# EAGLE design SympleEncoderBoard (EAGLE 9.6.2)
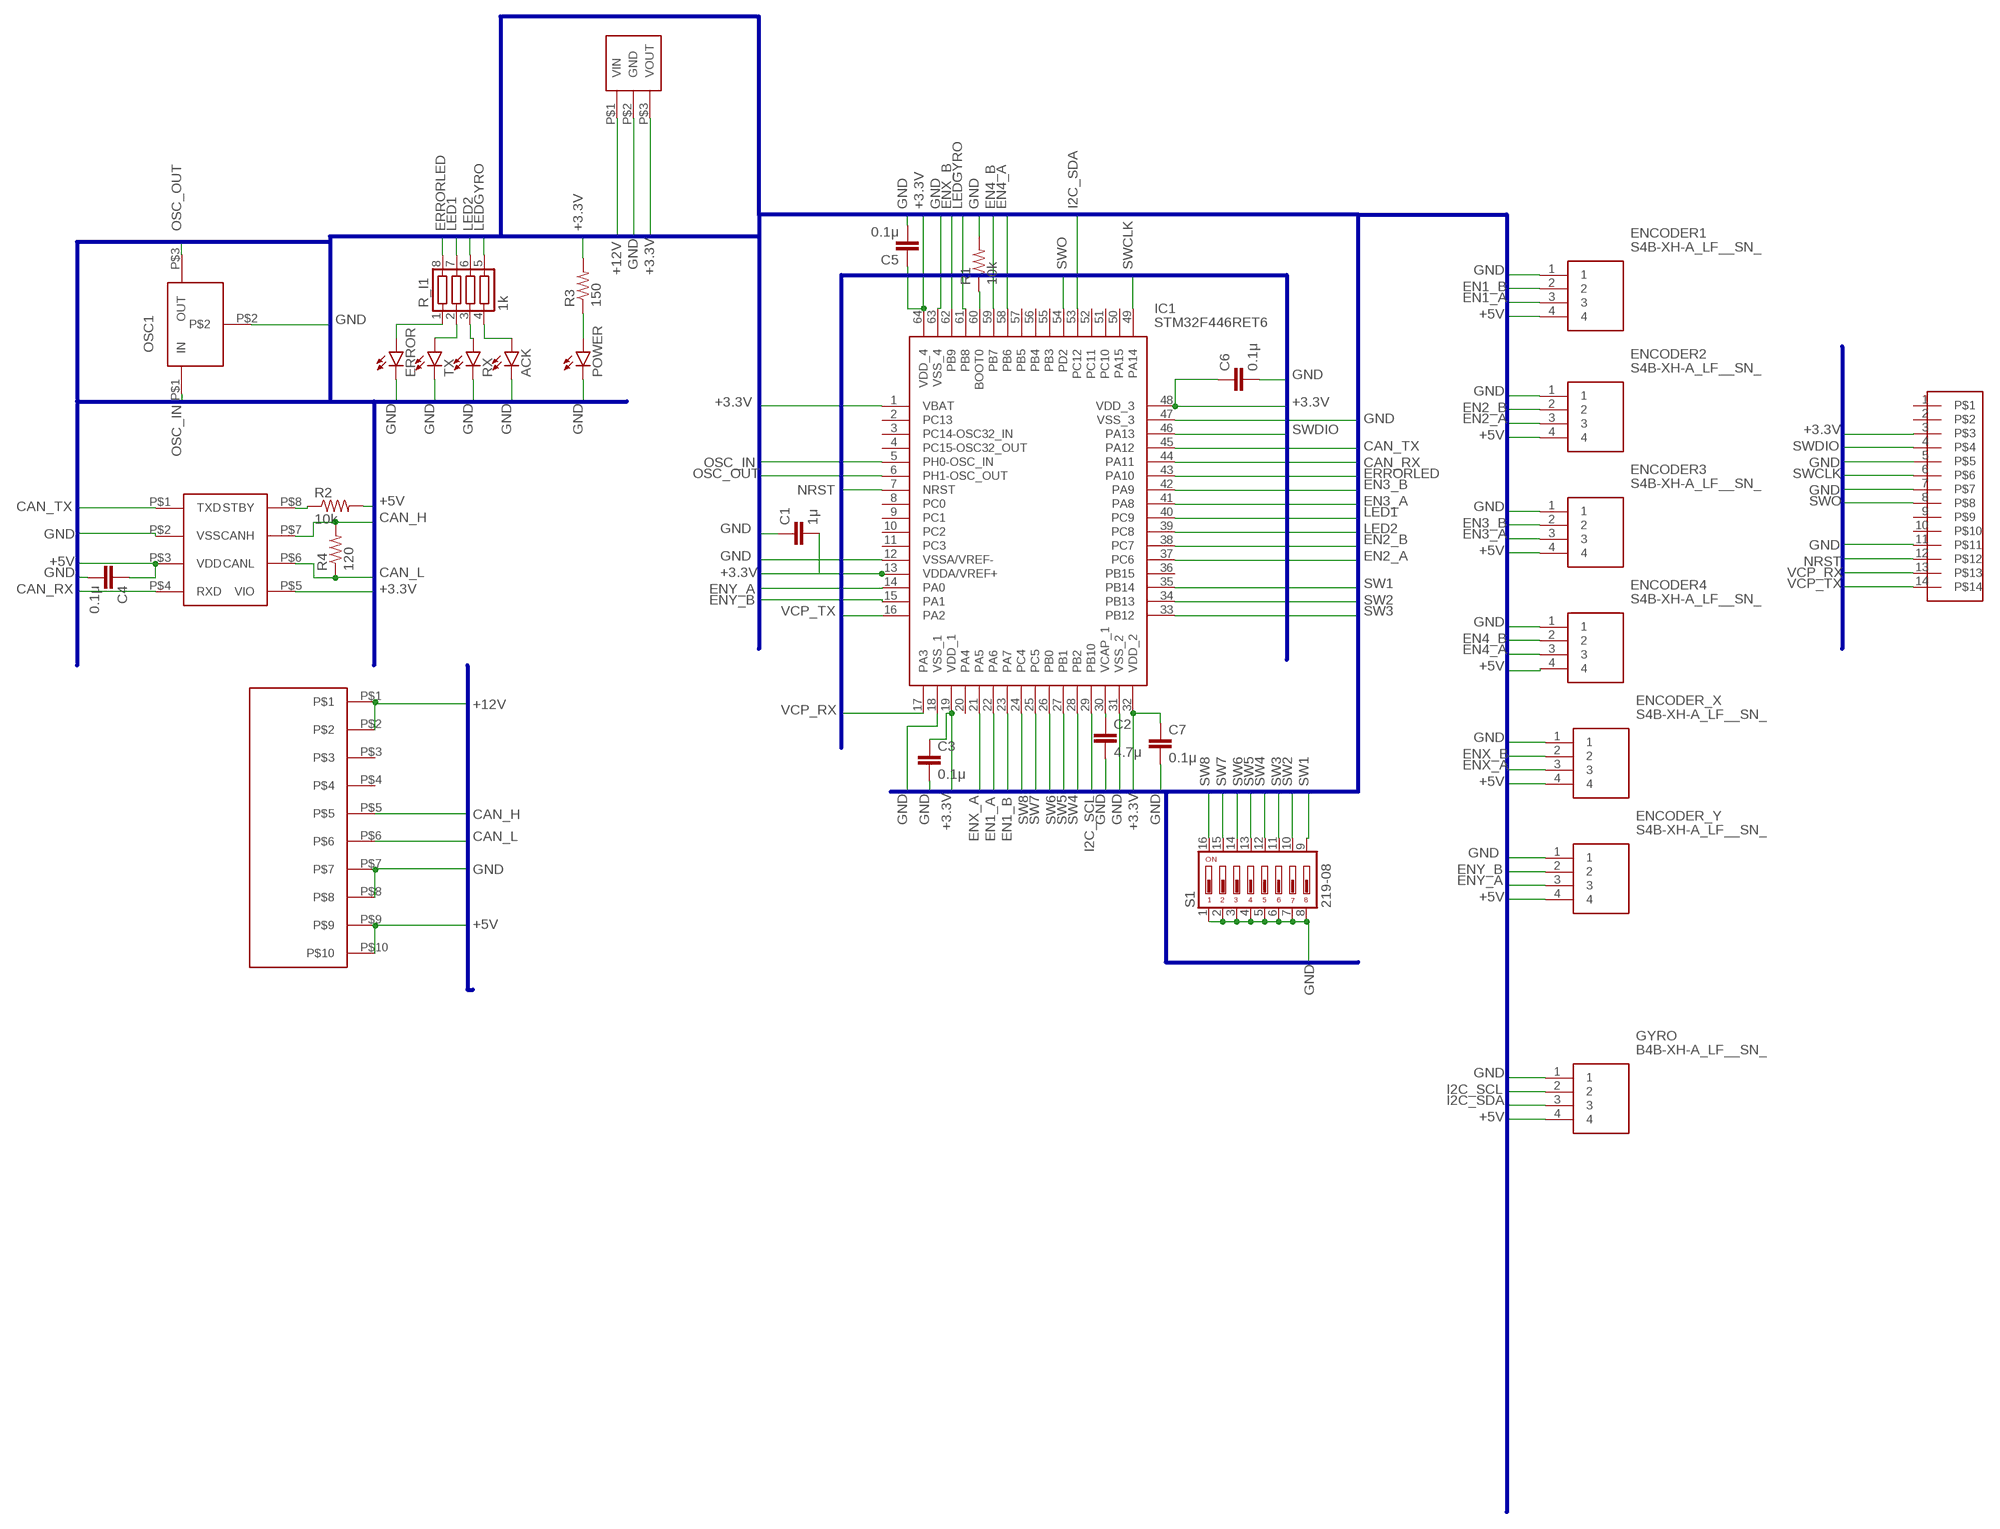
[diagram p0: schematic, sheet 1]

## Parts
ACK  LEDCHIPLED_0603  [CHIPLED_0603]
C1  1μ  C-EUC1608  [C1608]
C2  4.7μ  C-EUC0603  [C0603]
C3  0.1μ  C-EUC0603  [C0603]
C4  0.1μ  C-EUC1608  [C1608]
C5  0.1μ  C-EUC0603  [C0603]
C6  0.1μ  C-EUC0603  [C0603]
C7  0.1μ  C-EUC0603  [C0603]
ENCODER1  S4B-XH-A_LF__SN_  [SHDRRA4W64P0X250_1X4_1240X1150]
ENCODER2  S4B-XH-A_LF__SN_  [SHDRRA4W64P0X250_1X4_1240X1150]
ENCODER3  S4B-XH-A_LF__SN_  [SHDRRA4W64P0X250_1X4_1240X1150]
ENCODER4  S4B-XH-A_LF__SN_  [SHDRRA4W64P0X250_1X4_1240X1150]
ENCODER_X  S4B-XH-A_LF__SN_  [SHDRRA4W64P0X250_1X4_1240X1150]
ENCODER_Y  S4B-XH-A_LF__SN_  [SHDRRA4W64P0X250_1X4_1240X1150]
ERROR  LEDCHIPLED_0603  [CHIPLED_0603]
GYRO  B4B-XH-A_LF__SN_  [SHDR4W64P0X250_1X4_1240X575X70]
IC1  STM32F446RET6  [QFP50P1200X1200X160-64N]
OSC1  CSTN#  [CSTNE#]
POWER  LEDCHIPLED_0603  [CHIPLED_0603]
R1  10k  R-US_R0603  [R0603]
R2  10k  R-US_R0603  [R0603]
R3  150  R-US_R0603  [R0603]
R4  120  R-US_R0603  [R0603]
R_I1  1k  R_SHUGOU  [0603X4RESISTOR]
RX  LEDCHIPLED_0603  [CHIPLED_0603]
S1  219-08  [CTS-219-08]
TX  LEDCHIPLED_0603  [CHIPLED_0603]
U$1  BOX14P  [CON_HEDA14P_1.27]
U$2  BP5293-33  [DC/DC_REGULATOR_3P]
U$3  MCP2562MCP2561-SN  [SOIC8]
U$4  BOX10PBOX10P-L  [BOX10P-L]

## Nets
+3.3V: C1.2 C3.1 C5.1 C6.1 C7.1 IC1.1(VBAT) IC1.13(VDDA/VREF+) IC1.19(VDD_1) IC1.32(VDD_2) IC1.48(VDD_3) IC1.64(VDD_4) R3.2 U$1.3 U$2.P$3(VOUT) U$3.P$5(VIO)
+5V: C4.1 ENCODER1.4 ENCODER2.4 ENCODER3.4 ENCODER4.4 ENCODER_X.4 ENCODER_Y.4 GYRO.4 R2.2 U$3.P$3(VDD) U$4.P$9 U$4.P$10
+12V: U$2.P$1(VIN) U$4.P$1 U$4.P$2
CAN_H: R4.2 U$3.P$7(CANH) U$4.P$5
CAN_L: R4.1 U$3.P$6(CANL) U$4.P$6
CAN_RX: IC1.44(PA11) U$3.P$4(RXD)
CAN_TX: IC1.45(PA12) U$3.P$1(TXD)
EN1_A: ENCODER1.3 IC1.22(PA6)
EN1_B: ENCODER1.2 IC1.23(PA7)
EN2_A: ENCODER2.3 IC1.37(PC6)
EN2_B: ENCODER2.2 IC1.38(PC7)
EN3_A: ENCODER3.3 IC1.41(PA8)
EN3_B: ENCODER3.2 IC1.42(PA9)
EN4_A: ENCODER4.3 IC1.58(PB6)
EN4_B: ENCODER4.2 IC1.59(PB7)
ENX_A: ENCODER_X.3 IC1.21(PA5)
ENX_B: ENCODER_X.2 IC1.62(PB9)
ENY_A: ENCODER_Y.3 IC1.14(PA0)
ENY_B: ENCODER_Y.2 IC1.15(PA1)
ERRORLED: IC1.43(PA10) R_I1.8
GND: ACK.C C1.1 C2.2 C3.2 C4.2 C5.2 C6.2 C7.2 ENCODER1.1 ENCODER2.1 ENCODER3.1 ENCODER4.1 ENCODER_X.1 ENCODER_Y.1 ERROR.C GYRO.1 IC1.12(VSSA/VREF-) IC1.18(VSS_1) IC1.31(VSS_2) IC1.47(VSS_3) IC1.63(VSS_4) OSC1.P$2 POWER.C R1.2 RX.C S1.1 S1.2 S1.3 S1.4 S1.5 S1.6 S1.7 S1.8 TX.C U$1.5 U$1.7 U$1.11 U$2.P$2(GND) U$3.P$2(VSS) U$4.P$7 U$4.P$8
I2C_SCL: GYRO.2 IC1.29(PB10)
I2C_SDA: GYRO.3 IC1.53(PC12)
LED1: IC1.40(PC9) R_I1.7
LED2: IC1.39(PC8) R_I1.6
LEDGYRO: IC1.61(PB8) R_I1.5
N$1: IC1.60(BOOT0) R1.1
N$2: C2.1 IC1.30(VCAP_1)
N$3: ERROR.A R_I1.1
N$4: R_I1.2 TX.A
N$5: R_I1.3 RX.A
N$6: ACK.A R_I1.4
N$7: R2.1 U$3.P$8(STBY)
N$8: POWER.A R3.1
NRST: IC1.7(NRST) U$1.12
OSC_IN: IC1.5(PH0-OSC_IN) OSC1.P$1(IN)
OSC_OUT: IC1.6(PH1-OSC_OUT) OSC1.P$3(OUT)
SW1: IC1.35(PB14) S1.9
SW2: IC1.34(PB13) S1.10
SW3: IC1.33(PB12) S1.11
SW4: IC1.28(PB2) S1.12
SW5: IC1.27(PB1) S1.13
SW6: IC1.26(PB0) S1.14
SW7: IC1.25(PC5) S1.15
SW8: IC1.24(PC4) S1.16
SWCLK: IC1.49(PA14) U$1.6
SWDIO: IC1.46(PA13) U$1.4
SWO: IC1.54(PD2) U$1.8
VCP_RX: IC1.17(PA3) U$1.13
VCP_TX: IC1.16(PA2) U$1.14
Unconnected: IC1.2(PC13) IC1.3(PC14-OSC32_IN) IC1.4(PC15-OSC32_OUT) IC1.8(PC0) IC1.9(PC1) IC1.10(PC2) IC1.11(PC3) IC1.20(PA4) IC1.36(PB15) IC1.50(PA15) IC1.51(PC10) IC1.52(PC11) IC1.55(PB3) IC1.56(PB4) IC1.57(PB5) U$1.1 U$1.2 U$1.9 U$1.10 U$4.P$3 U$4.P$4

## Buses
+3.3V,GND,NRST,SWCLK,SWDIO,SWO,VCP_RX,VCP_TX
+3.3V,+5V,+12V,CAN_H,CAN_L,CAN_RX,CAN_TX,EN1_A,EN1_B,EN2_A,EN2_B,EN3_A,EN3_B,EN4_A,EN4_B,ENX_A,ENX_B,ENY_A,ENY_B,ERRORLED,GND,I2C_SCL,I2C_SDA,LED1,LED2,LEDGYRO,OSC_IN,OSC_OUT,SW1,SW2,SW3,SW4,SW5,SW6,SW7,SW8,SW9
+5V,+12V,CAN_H,CAN_L,GND

## Library data of the parts
ACK ERROR POWER RX TX = led:LED: LED OSRAM: - CHIPLED LG R971, LG N971, LY N971, LG Q971, LY Q971, LO R971, LY R971 LH N974, LH R974 LS Q976, LO Q976, LY Q976 LO Q996 - Hyper CHIPLED LW Q18S LB Q993, LB Q99A, LB R99A - SideLED LS A670, LO A670, LY A670, LG A670, LP A670 LB A673, LV A673, LT A673, LW A673 LH A674 LY A675 LS A676, LA A676, LO A676, LY A676, LW A676 LS A679, LY A679, LG A679 - Hyper Micro SIDELED® LS Y876, LA Y876, LO Y876, LY Y876 LT Y87S - SmartLED LW L88C, LW L88S LB L89C, LB L89S, LG L890 LS L89K, LO L89K, LY L89K LS L896, LA L896, LO L896, LY L896 - TOPLED LS T670, LO T670, LY T670, LG T670, LP T670 LSG T670, LSP T670, LSY T670, LOP T670, LYG T670 LG T671, LOG T671, LSG T671 LB T673, LV T673, LT T673, LW T673 LH T674 LS T676, LA T676, LO T676, LY T676, LB T676, LH T676, LSB T676, LW T676 LB T67C, LV T67C, LT T67C, LS T67K, LO T67K, LY T67K, LW E67C LS E67B, LA E67B, LO E67B, LY E67B, LB E67C, LV E67C, LT E67C LW T67C LS T679, LY T679, LG T679 LS T770, LO T770, LY T770, LG T770, LP T770 LB T773, LV T773, LT T773, LW T773 LH T774 LS E675, LA E675, LY E675, LS T675 LS T776, LA T776, LO T776, LY T776, LB T776 LHGB T686 LT T68C, LB T68C - Hyper Mini TOPLED® LB M676 - Mini TOPLED Santana® LG M470 LS M47K, LO M47K, LY M47K Source: http://www.osram.convergy.de LUXEON: - LUMILED® LXK2-PW12-R00, LXK2-PW12-S00, LXK2-PW14-U00, LXK2-PW14-V00 LXK2-PM12-R00, LXK2-PM12-S00, LXK2-PM14-U00 LXK2-PE12-Q00, LXK2-PE12-R00, LXK2-PE12-S00, LXK2-PE14-T00, LXK2-PE14-U00 LXK2-PB12-K00, LXK2-PB12-L00, LXK2-PB12-M00, LXK2-PB14-N00, LXK2-PB14-P00, LXK2-PB14-Q00 LXK2-PR12-L00, LXK2-PR12-M00, LXK2-PR14-Q00, LXK2-PR14-R00 LXK2-PD12-Q00, LXK2-PD12-R00, LXK2-PD12-S00 LXK2-PH12-R00, LXK2-PH12-S00 LXK2-PL12-P00, LXK2-PL12-Q00, LXK2-PL12-R00 Source: www.luxeon.com KINGBRIGHT: KA-3528ASYC Source: www.kingbright.com
C1-C7 = rcl:C-EU: CAPACITOR, European symbol; SPICEPREFIX: C
ENCODER1-ENCODER4 ENCODER_X ENCODER_Y = S4B-XH-A_LF__SN_:S4B-XH-A_LF__SN_: XH-2.5mm Header side entry 4 way JST XH Series, Series Number S4B, 2.5mm Pitch 4 Way 1 Row Right Angle PCB Header, Solder Termination, 3A Source: Datasheet <http://uk.rs-online.com/web/p/products/8201589P>; DESCRIPTION: XH-2.5mm Header side entry 4 way JST XH Series, Series Number S4B, 2.5mm Pitch 4 Way 1 Row Right Angle PCB Header, Solder Termination, 3A; HEIGHT: 7mm; MANUFACTURER_NAME: JST (JAPAN SOLDERLESS TERMINALS); MANUFACTURER_PART_NUMBER: S4B-XH-A(LF)(SN); RS_PART_NUMBER: 8201589P; RS_PRICE-STOCK: http://uk.rs-online.com/web/p/products/8201589P
GYRO = B4B-XH-A_LF__SN_:B4B-XH-A_LF__SN_: XH-2.5mm Header top entry 4 way JST XH Series, Series Number B4B, 2.5mm Pitch 4 Way 1 Row Straight PCB Header, Solder Termination, 3A Source: Datasheet <http://uk.rs-online.com/web/p/products/8201551P>; DESCRIPTION: XH-2.5mm Header top entry 4 way JST XH Series, Series Number B4B, 2.5mm Pitch 4 Way 1 Row Straight PCB Header, Solder Termination, 3A; HEIGHT: 7mm; MANUFACTURER_NAME: JST (JAPAN SOLDERLESS TERMINALS); MANUFACTURER_PART_NUMBER: B4B-XH-A(LF)(SN); RS_PART_NUMBER: 8201551P; RS_PRICE-STOCK: http://uk.rs-online.com/web/p/products/8201551P
IC1 = STM32F446RET6:STM32F446RET6: 32-Bit MCU+DSP 512K Flash 180MHz LQFP64 STMicroelectronics STM32F446RET6, 32bit ARM Cortex M4 MCU, 180MHz, 512 kB Flash, 64-Pin LQFP Source: Datasheet <http://uk.rs-online.com/web/p/products/1106621P>; DESCRIPTION: 32-Bit MCU+DSP 512K Flash 180MHz LQFP64 STMicroelectronics STM32F446RET6, 32bit ARM Cortex M4 MCU, 180MHz, 512 kB Flash, 64-Pin LQFP; HEIGHT: 1.6mm; MANUFACTURER_NAME: STMicroelectronics; MANUFACTURER_PART_NUMBER: STM32F446RET6; RS_PART_NUMBER: 1106621P; RS_PRICE-STOCK: http://uk.rs-online.com/web/p/products/1106621P
OSC1 = user_osc:CSTN#: ムラタのセラロック （セラミック振動子） 周波数はいくつか種類あり(valueで設定して) 秋月電子通商のトップ/パーツ一般/発振子/セラミック発振子 uCからのoutが入るのがinであることに注意 https://akizukidenshi.com/catalog/c/cceralock/
R1-R4 = rcl:R-US_: RESISTOR, American symbol; SPICEPREFIX: R
R_I1 = user_rcl:R_SHUGOU
S1 = switch-dil:219-08*: Surface Mount DIP Switch Series 219 SMT CTS Electronic Components Sourc: www.ctscorp.com; OC_FARNELL: unknown; OC_NEWARK: unknown
U$1 = user_conector:BOX14P
U$2 = SympleEncoderBoard:BP5293-33
U$3 = user_ic:MCP2562
U$4 = user_conector:BOX10P

## Board
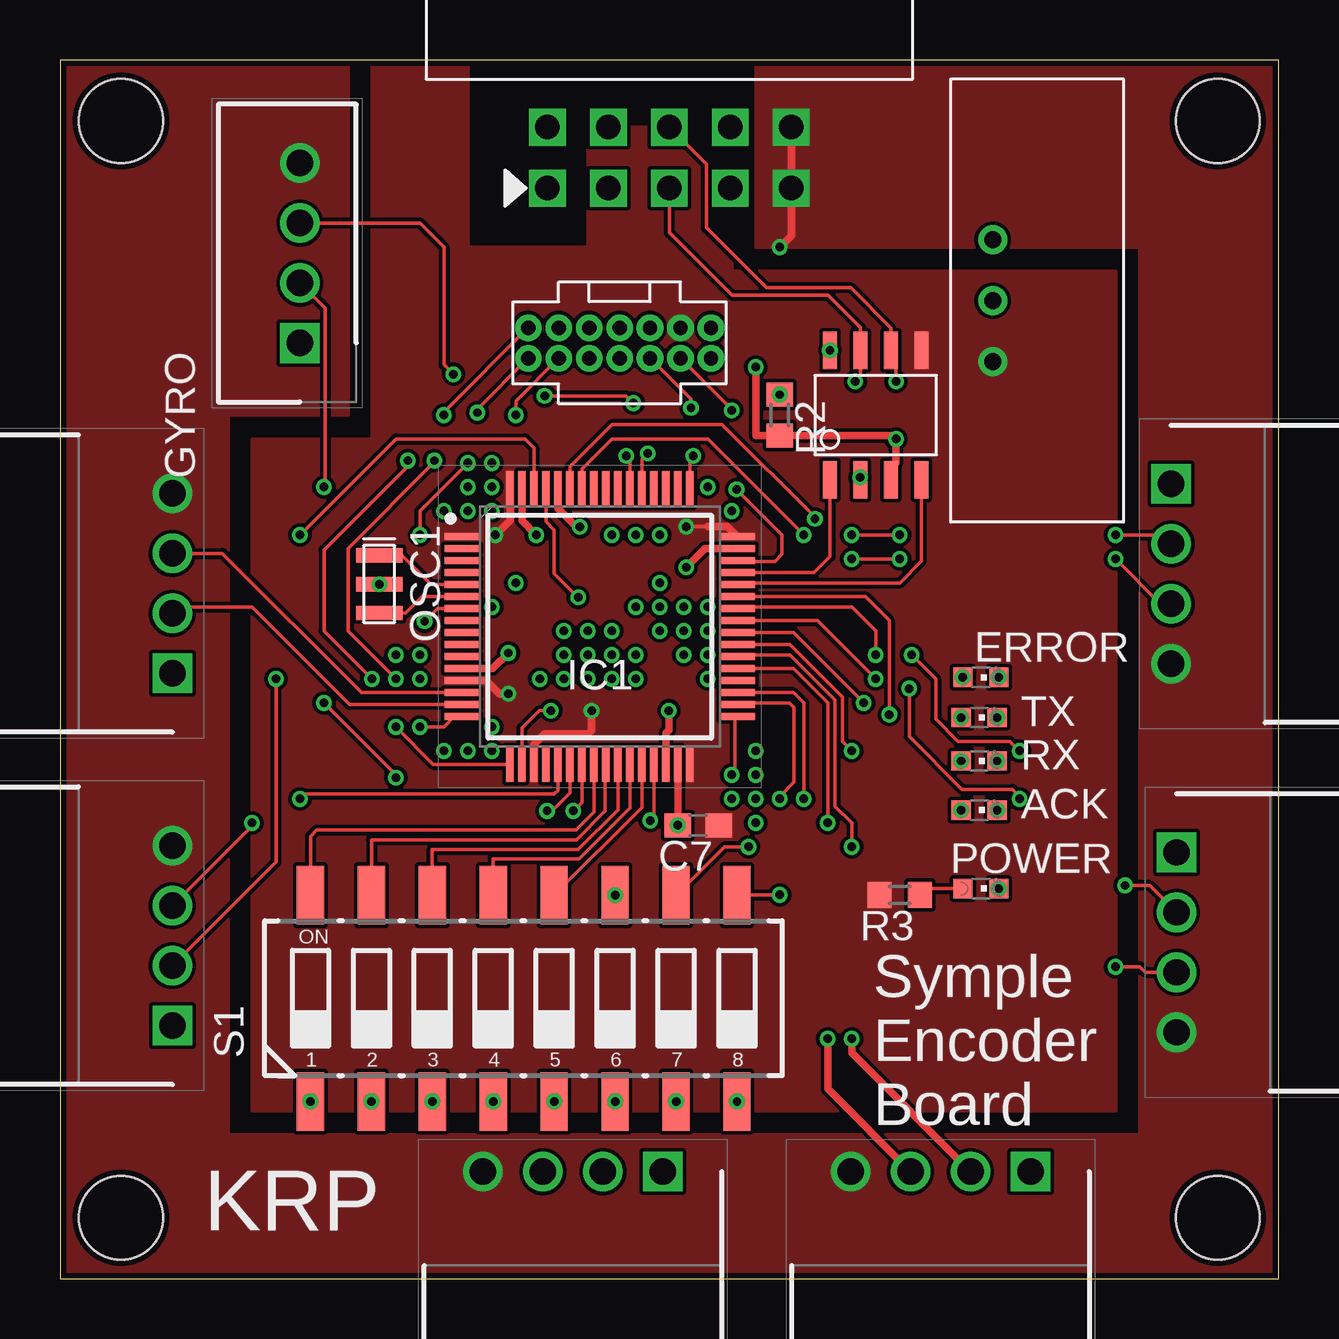
[diagram p1: board, top side]
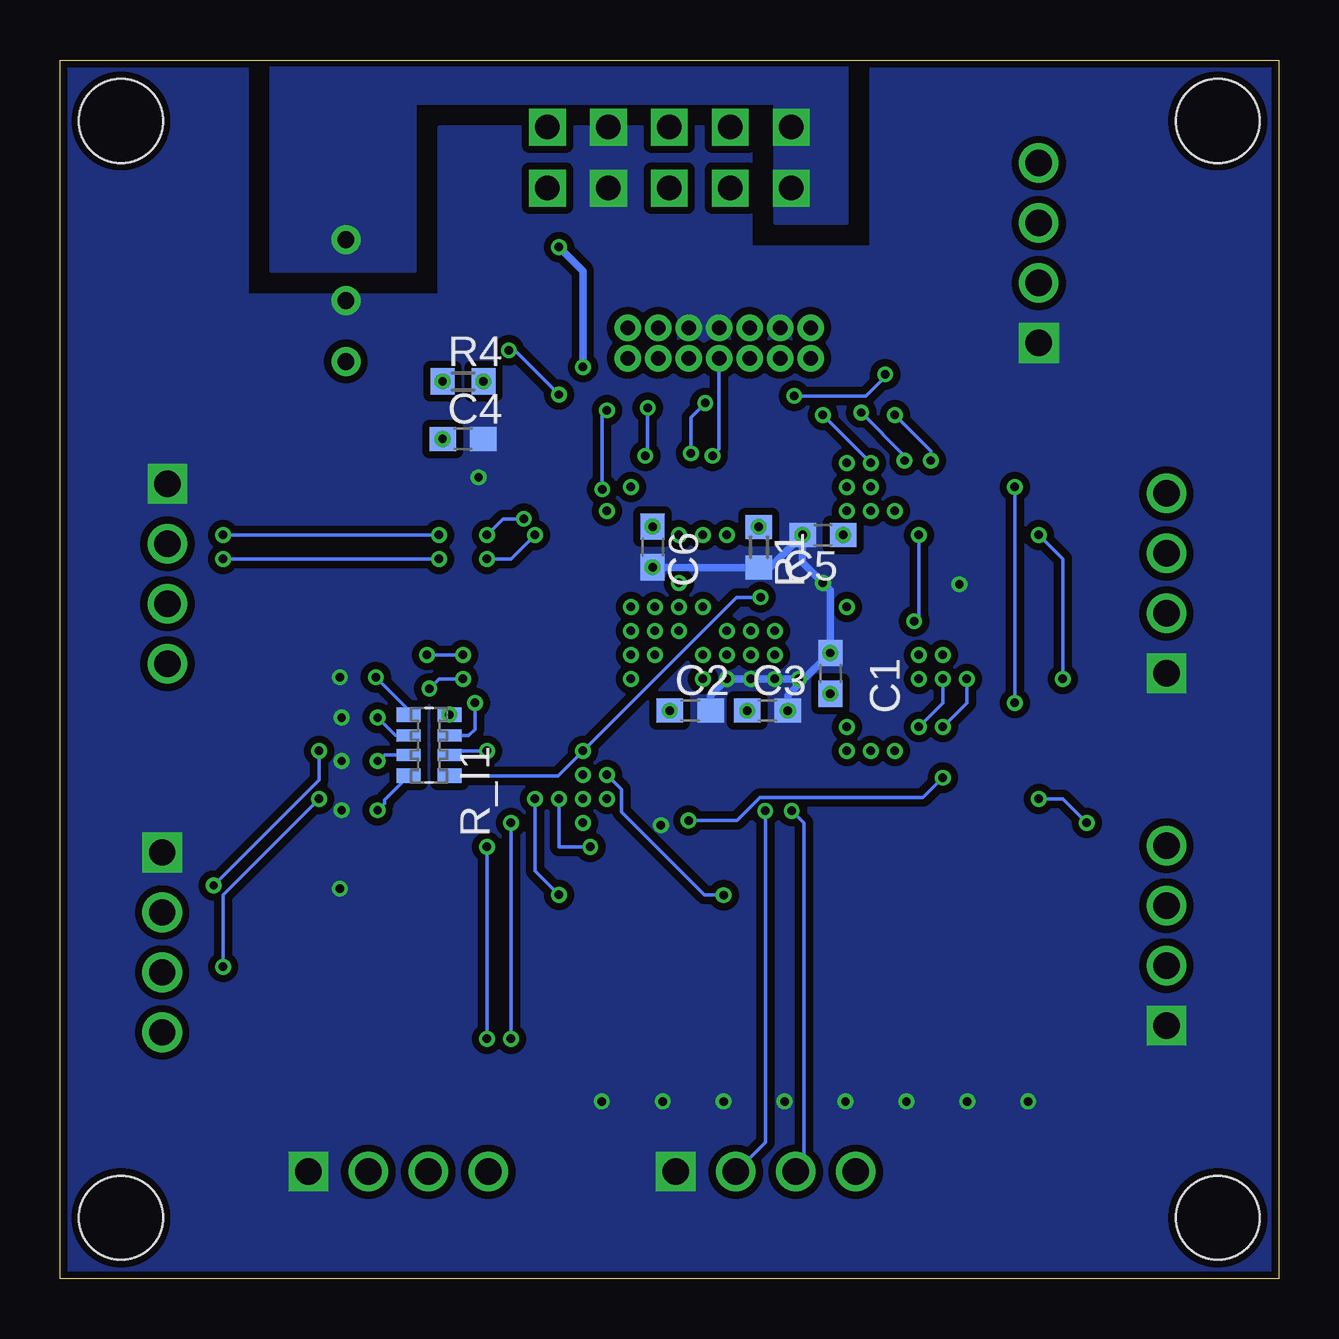
[diagram p2: board, bottom side, seen from below]

Size 50.8 x 50.8 mm. Coordinates in mm from the lower left corner, seen from the top.
Outline: 0,0 50.8,0 50.8,50.8 0,50.8 0,0
Copper layers (1*16): Top 0.035mm / dielectric 1.5mm / Bottom 0.035mm
Design rules "SeeedStudio_2layer_DRU_no_angle_20140221": minimum track width 6mil, minimum drill 12mil, track to track 6mil, track to pad 6mil, pad to pad 6mil, via to via 6mil, smd to smd 0mil, copper to edge 10mil, drill to drill 10mil, minimum pad ring 10mil, minimum via ring 6mil, stop-mask expansion 2mil, vias tented up to drill 100mil, thermal gap 10mil
Holes 3.5 mm at 2.54,2.54 48.26,2.54 48.26,48.26 2.54,48.26

### Footprints (pad centres in the part's own frame; a part is rotated, then mirrored left to right if it is on the bottom)
CHIPLED_0603 = smd 0.8 x 0.8: A 0,-0.75; C 0,0.75
C1608 = smd 1.1 x 1: 1 -0.85,0; 2 0.85,0
C0603 = smd 1.1 x 1: 1 -0.85,0; 2 0.85,0
SHDRRA4W64P0X250_1X4_1240X1150 = drill 1.1 pad 1.65 square: 1 0,0 | drill 1.1 pad 1.65: 2 2.5,0; 3 5,0; 4 7.5,0
SHDR4W64P0X250_1X4_1240X575X70 = drill 1.1 pad 1.65 square: 1 0,0 | drill 1.1 pad 1.65: 2 2.5,0; 3 5,0; 4 7.5,0
QFP50P1200X1200X160-64N = smd 1.475 x 0.3: 1 -5.738,3.75; 2 -5.738,3.25; 3 -5.738,2.75; 4 -5.738,2.25; 5 -5.738,1.75; 6 -5.738,1.25; 7 -5.738,0.75; 8 -5.738,0.25; 9 -5.738,-0.25; 10 -5.738,-0.75; 11 -5.738,-1.25; 12 -5.738,-1.75; 13 -5.738,-2.25; 14 -5.738,-2.75; 15 -5.738,-3.25; 16 -5.738,-3.75; 33 5.738,-3.75; 34 5.738,-3.25; 35 5.738,-2.75; 36 5.738,-2.25; 37 5.738,-1.75; 38 5.738,-1.25; 39 5.738,-0.75; 40 5.738,-0.25; 41 5.738,0.25; 42 5.738,0.75; 43 5.738,1.25; 44 5.738,1.75; 45 5.738,2.25; 46 5.738,2.75; 47 5.738,3.25; 48 5.738,3.75 | smd 0.3 x 1.475: 17 -3.75,-5.738; 18 -3.25,-5.738; 19 -2.75,-5.738; 20 -2.25,-5.738; 21 -1.75,-5.738; 22 -1.25,-5.738; 23 -0.75,-5.738; 24 -0.25,-5.738; 25 0.25,-5.738; 26 0.75,-5.738; 27 1.25,-5.738; 28 1.75,-5.738; 29 2.25,-5.738; 30 2.75,-5.738; 31 3.25,-5.738; 32 3.75,-5.738; 49 3.75,5.738; 50 3.25,5.738; 51 2.75,5.738; 52 2.25,5.738; 53 1.75,5.738; 54 1.25,5.738; 55 0.75,5.738; 56 0.25,5.738; 57 -0.25,5.738; 58 -0.75,5.738; 59 -1.25,5.738; 60 -1.75,5.738; 61 -2.25,5.738; 62 -2.75,5.738; 63 -3.25,5.738; 64 -3.75,5.738
CSTNE# = smd 0.6 x 1.95: P$1 0,0; P$2 1.2,0; P$3 2.4,0
R0603 = smd 1 x 1.1: 1 -0.85,0; 2 0.85,0
0603X4RESISTOR = smd 0.6 x 1: 1 -1.275,-0.85; 4 1.275,-0.85; 5 1.275,0.85; 8 -1.275,0.85 | smd 0.5 x 1: 2 -0.4,-0.85; 3 0.4,-0.85; 6 0.4,0.85; 7 -0.4,0.85
CTS-219-08 = smd 1.13 x 2.44: 1 -8.89,-4.3; 2 -6.35,-4.3; 3 -3.81,-4.3; 4 -1.27,-4.3; 5 1.27,-4.3; 6 3.81,-4.3; 7 6.35,-4.3; 8 8.89,-4.3; 9 8.89,4.3; 10 6.35,4.3; 11 3.81,4.3; 12 1.27,4.3; 13 -1.27,4.3; 14 -3.81,4.3; 15 -6.35,4.3; 16 -8.89,4.3
CON_HEDA14P_1.27 = drill 0.6: 1 1.08,8.255; 2 2.35,8.255; 3 1.08,6.985; 4 2.35,6.985; 5 1.08,5.715; 6 2.35,5.715; 7 1.08,4.445; 8 2.35,4.445; 9 1.08,3.175; 10 2.35,3.175; 11 1.08,1.905; 12 2.35,1.905; 13 1.08,0.635; 14 2.35,0.635
DC/DC_REGULATOR_3P = drill 0.7: P$1 -2.54,0; P$2 0,0; P$3 2.54,0
SOIC8 = smd 1.55 x 0.6: P$1 -2.7,1.905; P$2 -2.7,0.635; P$3 -2.7,-0.635; P$4 -2.7,-1.905; P$5 2.7,-1.905; P$6 2.7,-0.635; P$7 2.7,0.635; P$8 2.7,1.905
BOX10P-L = drill 1.02 square: P$1 5.08,2.54; P$2 5.08,0; P$3 2.54,2.54; P$4 2.54,0; P$5 0,2.54; P$6 0,0; P$7 -2.54,2.54; P$8 -2.54,0; P$9 -5.08,2.54; P$10 -5.08,0

### Placement (x,y rotation side)
ACK  38.31,19.53 270 top
C1  18.69,25.23 270 bottom
C2  24.53,23.68 0 bottom
C3  21.31,23.68 0 bottom
C4  34,35 0 bottom
C5  19,31 180 bottom
C6  26.1,30.5 270 bottom
C7  26.6,18.9 180 top
ENCODER1  25.13,4.46 180 top
ENCODER2  40.45,4.46 180 top
ENCODER3  46.54,17.77 270 top
ENCODER4  46.32,33.13 270 top
ENCODER_X  4.68,10.55 90 top
ENCODER_Y  4.68,25.23 90 top
ERROR  38.38,25.07 270 top
GYRO  10,39 90 top
IC1  22.5,27.18 0 top
OSC1  13.31,30.15 270 top
POWER  38.38,16.26 270 top
R1  21.67,30.49 270 bottom
R2  30,36 270 top
R3  35,16 180 top
R4  34,37.4 0 bottom
R_I1  35.42,22.24 270 bottom
RX  38.31,21.58 270 top
S1  19.33,11.69 0 top
TX  38.31,23.39 270 top
U$1  18.88,40.72 270 top
U$2  38.88,40.77 270 top
U$3  34,36 90 top
U$4  25.4,48 180 top

### Tracks (layer width: path | path; a pad name or v marks a point on that pad's centre or on a via)
+3.3V  (via drill 0.35)
  Top 0.152: C6.1 27,31.35
  Top 0.305: IC1.64 18.75,31.6 C5.1 | C1.2 18.32,24.38 17.77,24.93 IC1.13 | 27,31.35 27.82,31.35 IC1.48 | C3.1 22.16,22.86 22,22.7 20.19,22.7 19.75,22.26 IC1.19
  other vias: 18.15,31 18.69,24.38 26.1,31.35 22.16,23.68
  pour Top (rank 3, no thermals): 8,7 44,7 44,42 28,42 28,48 22,48 22,43 17,43 17,51 13,51 13,35 8,35
+5V  (via drill 0.35)
  Top 0.305: U$3.P$3 34.63,33.78 34.85,34 C4.1 34.7,35.15 R2.2 29,35.15 v29,38 | U$4.P$10 U$4.P$9 30.48,43.48 v30,43
  Bottom 0.305: v30,43 29,42 v29,38
  other vias: 34.85,35
  pour Top (no thermals): 29,51 29,43 45,43 45,6 7,6 7,36 12,36 12,51 0,51 0,0 51,0 51,51
+12V
  pour Bottom (no thermals): 21,44 21,49 36,49 36,42 42,42 42,51 18,51 18,44
CAN_H  (via drill 0.35)
  Top 0.152: R4.2 33.37,37.62 U$3.P$7 33.37,39.63 32,41 28,41 25.4,43.6 U$4.P$5
  other vias: 33.15,37.4
CAN_L  (via drill 0.35)
  Top 0.152: R4.1 34.85,38.48 U$3.P$6 34.63,39.63 32.96,41.3 29.44,41.3 26.95,43.8 26.95,46.45 U$4.P$6
  other vias: 34.85,37.4
CAN_RX
  Top 0.152: IC1.44 28.31,29 35,29 35.91,29.91 U$3.P$4
CAN_TX
  Top 0.152: IC1.45 31.43,29.43 32.09,30.09 U$3.P$1
EN1_A  (via drill 0.35)
  Top 0.152: IC1.22 21.25,20.25 20.5,19.5 v20.3,19.5
  Bottom 0.152: v20.3,19.5 19.8,19 19.8,4.79 ENCODER1.3
EN1_B  (via drill 0.35)
  Top 0.152: IC1.23 21.75,19.85 v21.4,19.5
  Bottom 0.152: v21.4,19.5 21.4,5.69 ENCODER1.2
EN2_A  (via drill 0.35)
  Top 0.152: v32,19 32,24 30.57,25.43 IC1.37
  Top 0.305: ENCODER2.3 32,7.91 v32,10
  Bottom 0.152: v32,10 v32,19
EN2_B  (via drill 0.35)
  Top 0.152: IC1.38 28.31,26 30.43,26 32.3,24.13 32.3,19.7 33,19 v33,18
  Top 0.305: v33,10 33,9.41 ENCODER2.2
  Bottom 0.152: v33,18 v33,10
EN3_A  (via drill 0.35)
  Top 0.152: IC1.41 31.57,27.43 v34,25 | v35.4,24.6 35.4,22.6 37.6,20.4 39.7,20.4 40,20.1 v40,20 | ENCODER3.3 45.23,12.77 45,13 v44,13
  Bottom 0.152: v34,25 35,25 v35.4,24.6 | v40,20 44,16 v44,13
EN3_B  (via drill 0.35)
  Top 0.152: IC1.42 28.31,28 33,28 34,27 v34,26 | v35.5,26 36.5,25 36.5,23.33 37.43,22.4 39.6,22.4 v40,22 | ENCODER3.2 45.42,16.39 v44.39,16.39
  Bottom 0.152: v34,26 v35.5,26 | v44.39,16.39 40,20.79 v40,22
EN4_A  (via drill 0.35)
  Top 0.152: ENCODER4.3 45.87,28.13 v44,30 | v35,30 v33,30 | v31,31 27,35 23,35 21.75,33.75 IC1.58
  Bottom 0.152: v44,30 v35,30 | v33,30 32,30 v31,31
EN4_B  (via drill 0.35)
  Top 0.152: IC1.59 21.25,33.85 23,35.6 27.6,35.6 31.5,31.7 v31.47,31.67 | v33,31 v35,31 | v44,31 45.95,31 ENCODER4.2
  Bottom 0.152: v31.47,31.67 32.33,31.67 v33,31 | v35,31 v44,31
ENX_A  (via drill 0.35)
  Top 0.152: ENCODER_X.3 8,18.87 v8,19 | v10,20 10.2,20.2 20.6,20.2 20.75,20.35 IC1.21
  Bottom 0.152: v8,19 9,20 v10,20
ENX_B  (via drill 0.35)
  Top 0.152: ENCODER_X.2 9,17.37 v9,25 | v10,31 14,35 19.38,35 19.75,34.63 IC1.62
  Bottom 0.152: v9,25 9,30 v10,31
ENY_A
  Top 0.152: ENCODER_Y.3 6.77,30.23 12.57,24.43 IC1.14
ENY_B
  Top 0.152: IC1.15 12.07,23.93 8,28 4.95,28 ENCODER_Y.2
ERRORLED  (via drill 0.35)
  Top 0.152: IC1.43 33.57,28.43 34.57,27.43 v34.57,23.52
GND  (via drill 0.35)
  Top 0.152: IC1.18 19.25,22.95 19.98,23.68 C3.2
  Top 0.305: IC1.63 19.25,31.6 C5.2 | C1.1 18.04,25.43 IC1.12 | C6.2 26.88,30.43 IC1.47 | U$3.P$2 33.35,33.31 v33.35,33.4 | IC1.31 C7.2
  Bottom 0.305: C3.2 20.46,24.31 19.89,24.89 | 19.89,24.89 C1.1 18.69,28.69 v19,29 19.85,29.85 C5.2 21.21,29.64 R1.2 C6.2 | 19.89,24.89 v20,25 v21,25 v22,25 v23,25 23.68,24.32 C2.2
  other vias: 19.85,31 18.69,26.08 26.1,29.65 13.31,28.95 25.75,18.9 39.06,19.53 39.06,21.58 39.06,23.39 39.13,25.07 39.13,16.26 10.44,7.39 12.98,7.39 15.52,7.39 18.06,7.39 20.6,7.39 23.14,7.39 25.68,7.39 28.22,7.39 20.46,23.68
  pour Bottom (isolate 0.305, no thermals): 0,51 17,51 17,43 22,43 22,48 35,48 35,41 43,41 43,51 51,51 51,0 0,0
I2C_SCL  (via drill 0.35)
  Top 0.152: v11,33 11.05,33.05 11.05,40.45 GYRO.2 | v11,24 14,21 v14,20.89 | v24.6,19.1 24.75,19.25 IC1.29
  Bottom 0.152: v11,33 v11,24 | v24.6,19.1 22.59,19.1 21.63,20.06 14.83,20.06 v14,20.89
I2C_SDA  (via drill 0.35)
  Top 0.152: v23.9,36.5 23.6,36.8 v20.2,36.8 | v16.4,37.7 16,38.1 16,43 15,44 GYRO.3 | v24.5,34.4 24.25,34.15 IC1.53
  Bottom 0.152: v23.9,36.5 24.5,35.9 v24.5,34.4 | v20.2,36.8 17.2,36.8 16.4,37.6 v16.4,37.7
LED1  (via drill 0.35)
  Top 0.152: v33.5,24 30.57,26.93 IC1.40
  Bottom 0.152: R_I1.7 33.76,22.64 33.5,22.9 v33.5,24
LED2  (via drill 0.35)
  Top 0.152: v33,22 32.61,22.39 32.61,24.25 30.43,26.43 IC1.39
  Bottom 0.152: v33,22 34.41,22 R_I1.6
LEDGYRO  (via drill 0.35)
  Top 0.152: v21.6,28.4 20.6,29.4 20.6,31.2 20.25,31.55 IC1.61
  Bottom 0.152: R_I1.5 30.04,20.96 v29,22 27,24 22.6,28.4 v21.6,28.4
N$1  (via drill 0.35)
  Top 0.305: R1.1 21.59,31.26 20.75,32.1 IC1.60
  other vias: 21.67,31.34
N$2  (via drill 0.35)
  Top 0.305: C2.1 25.38,22.88 25.25,22.75 IC1.30
  other vias: 25.38,23.68
N$3  (via drill 0.35)
  Bottom 0.152: ERROR.A 36.27,23.71 R_I1.1
  other vias: 37.63,25.07
N$4  (via drill 0.35)
  Bottom 0.152: R_I1.2 36.81,22.64 TX.A
  other vias: 37.56,23.39
N$5  (via drill 0.35)
  Bottom 0.152: RX.A 37.53,21.58 37.27,21.84 R_I1.3
  other vias: 37.56,21.58
N$6  (via drill 0.35)
  Bottom 0.152: ACK.A 37.27,19.82 37.27,19.96 R_I1.4
  other vias: 37.56,19.53
N$7  (via drill 0.35)
  Bottom 0.152: R2.1 31.85,38.7 U$3.P$8
  other vias: 30,36.85 32.09,38.7
N$8
  Top 0.152: R3.1 36.11,16.26 POWER.A
N$9  (via drill 0.35)
  other vias: 18,32
N$10  (via drill 0.35)
  other vias: 26,28
N$11  (via drill 0.35)
  other vias: 25,28
N$12  (via drill 0.35)
  other vias: 26,27
N$13  (via drill 0.35)
  other vias: 27,27
N$14  (via drill 0.35)
  other vias: 18,28
N$15  (via drill 0.35)
  other vias: 27,28
N$16  (via drill 0.35)
  other vias: 25,29
N$17  (via drill 0.35)
  other vias: 23,27
N$18  (via drill 0.35)
  other vias: 24,26
N$19  (via drill 0.35)
  other vias: 25,27
N$20  (via drill 0.35)
  other vias: 24,28
N$22  (via drill 0.35)
  other vias: 18,23
N$23  (via drill 0.35)
  other vias: 21,27
N$24  (via drill 0.35)
  other vias: 22,27
N$25  (via drill 0.35)
  other vias: 18,22
N$26  (via drill 0.35)
  other vias: 17,22
N$27  (via drill 0.35)
  other vias: 16,22
N$28  (via drill 0.35)
  other vias: 26,26
N$29  (via drill 0.35)
  other vias: 27,26
N$30  (via drill 0.35)
  other vias: 16,32
N$31  (via drill 0.35)
  other vias: 17,32
N$32  (via drill 0.35)
  other vias: 23,26
N$33  (via drill 0.35)
  other vias: 22,26
N$34  (via drill 0.35)
  other vias: 21,26
N$35  (via drill 0.35)
  other vias: 18,33
N$36  (via drill 0.35)
  other vias: 24,25
N$37  (via drill 0.35)
  other vias: 17,33
N$38  (via drill 0.35)
  other vias: 18,34
N$39  (via drill 0.35)
  other vias: 27,25
N$40  (via drill 0.35)
  other vias: 27,33
N$41  (via drill 0.35)
  other vias: 28,32
N$43  (via drill 0.35)
  other vias: 23,31
N$44  (via drill 0.35)
  other vias: 24,31
N$45  (via drill 0.35)
  other vias: 25,31
N$46  (via drill 0.35)
  other vias: 29,21
N$47  (via drill 0.35)
  other vias: 29,20
N$48  (via drill 0.35)
  other vias: 28,20
N$49  (via drill 0.35)
  other vias: 29,19
N$51  (via drill 0.35)
  other vias: 15,26
N$52  (via drill 0.35)
  other vias: 14,26
N$53  (via drill 0.35)
  other vias: 15,25
NRST  (via drill 0.35)
  Top 0.152: U$1.12 19,36.59 v19,36 | IC1.7 15.73,27.93 v15.2,27.4 | v15,31 15,32 v17,34
  Bottom 0.152: v15.2,27.4 15,27.6 v15,31 | v17,34 v19,36
OSC_IN
  Top 0.152: OSC1.P$1 14.25,30.15 15.47,28.93 IC1.5
OSC_OUT
  Top 0.152: OSC1.P$3 14.41,27.75 15.09,28.43 IC1.6
SW1  (via drill 0.35)
  Top 0.152: v30,16 v30,15.99 S1.9 | v31,20 31,24 30.57,24.43 IC1.35
  Bottom 0.152: v31,20 31,17 v30,16
SW2  (via drill 0.35)
  Top 0.152: IC1.34 28.31,24 30.4,24 30.6,23.8 30.6,20.7 30,20.1 v30,20 | v28.7,18 27.7,18 S1.10
  Bottom 0.152: v30,20 30,18 v28.7,18
SW3  (via drill 0.35)
  Top 0.152: v28,21 28.14,21.14 28.14,23.33 IC1.33
  Bottom 0.152: S1.11 23.94,15.99 27.4,19.45 27.4,20.4 v28,21
  other vias: 23.14,15.99
SW4
  Top 0.152: IC1.28 24.25,20 24.25,19.64 S1.12
SW5
  Top 0.152: IC1.27 23.75,19.62 21.63,17.5 18.06,17.5 S1.13
SW6
  Top 0.152: S1.14 15.52,17.9 21.6,17.9 23.25,19.55 IC1.26
SW7
  Top 0.152: IC1.25 22.73,21.42 22.73,19.5 21.53,18.3 12.98,18.3 S1.15
SW8
  Top 0.152: S1.16 10.44,18.44 10.7,18.7 21.5,18.7 22.25,19.45 IC1.24
SWCLK  (via drill 0.35)
  Top 0.152: U$1.6 26.3,36.66 v26.3,36.3 | v26.4,34.3 26.25,34.15 IC1.49
  Bottom 0.152: v26.3,36.3 26.3,34.4 v26.4,34.3
SWDIO  (via drill 0.35)
  Top 0.152: U$1.4 28,36.23 v28,36.2 | v28.2,32.9 30.1,31 30.1,30.2 29.8,29.9 28.27,29.9 IC1.46
  Bottom 0.152: v28,36.2 28.2,36 v28.2,32.9
SWO  (via drill 0.35)
  Top 0.152: IC1.54 23.75,34.15 v23.6,34.3
  Bottom 0.152: v23.6,34.3 23.32,34.58 U$1.8
VCP_RX  (via drill 0.35)
  Top 0.152: U$1.13 16,36.12 v16,36 | v14.5,34.1 14.5,33.88 11,30.38 11,27 v13,25 | v14,23 15.56,21.44 IC1.17
  Bottom 0.152: v16,36 14.5,34.5 v14.5,34.1 | v14,23 13,24 v13,25
VCP_TX  (via drill 0.35)
  Top 0.152: U$1.14 17.4,36.26 v17.4,36.1 | IC1.16 16.43,23.43 16,23 v15,23 | v14,25 12,27 12,30.44 15.6,34.04 v15.6,34.1
  Bottom 0.152: v17.4,36.1 15.6,34.3 v15.6,34.1 | v14,25 14,24 v15,23

### Text on the board
tNames: Symple / Encoder / Board | KRP